# Altium schematic sheet lna.SchDoc: RX LNA
size Letter; CheckedBy: J. Brinton; CompanyName: Signal Laboratories, Inc.; DrawnBy: J. Brinton; Engineer: J. Brinton; Address1: 3479 Edison Way; Address2: Menlo Park CA 94025; Address3: +1 (877) 778-8435; Address4: siglabs.com; Revision: 3; SheetNumber: 14; SheetTotal: 49
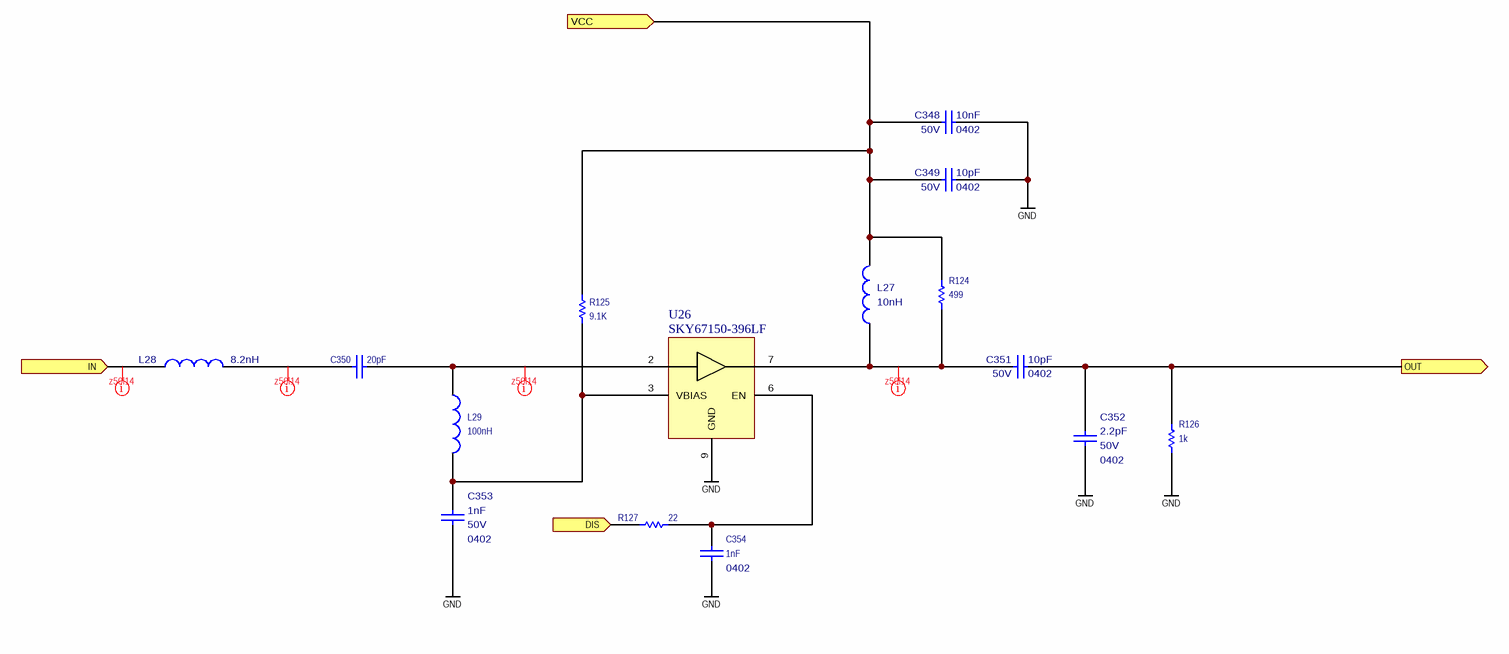
[diagram p0: lna.SchDoc]

## Parts
C348  value 10nF  Package: 0402  Voltage: 50V  [CAPC100X50X55L25N]  (hidden comment: GRM155R71H103KA88)
C349  value 10pF  Package: 0402  Voltage: 50V  [CAPC100X50X55L25N]  (hidden comment: VJ0402A100JXA)
C350  value 20pF  [CAPC100X50X55L25N]  (hidden comment: CBR04C200F5GAC)
C351  value 10pF  Package: 0402  Voltage: 50V  [CAPC100X50X55L25N]  (hidden comment: VJ0402A100JXA)
C352  value 2.2pF  Package: 0402  Voltage: 50V  [CAPC100X50X55L25N]  (hidden comment: VJ0402A2R2BXA)
C353  value 1nF  Package: 0402  Voltage: 50V  [CAPC100X50X55L25N]  (hidden comment: CGA2B2X7R1H102K050BA)
C354  value 1nF  Package: 0402  [CAPC100X50X55L25N]  (hidden comment: CGA2B2NP01H102J050BA)
L27  value 10nH  [INDC1005X55N]  (hidden comment: LQG15HS10NJ02D)
L28  value 8.2nH  [INDC1005X55N]  (hidden comment: LQG15HS8N2H02D)
L29  value 100nH  [INDC1005X55N]  (hidden comment: LQW15ANR10J00D)
R124  value 499  [RESC1005X40N]  (hidden comment: MCS0402PD4990DE500)
R125  value 9.1K  [RESC1005X40N]  (hidden comment: ERJ-2RKF9101X)
R126  value 1k  [RESC1005X40N]  (hidden comment: MCS0402PD1001DE500)
R127  value 22  [RESC1005X40N]  (hidden comment: RC0402FR-0722RL)
U26  SKY67150-396LF  [SON50P200X200X80-9N]

## Ports
DIS (in), IN (in), OUT (out), VCC (in)

## Nets
GND: C348.2 C349.2 C352.2 C353.2 C354.2 R126.1 U26.1(NC) U26.4(NC) U26.5(NC) U26.8(NC) U26.9(GND)
DIS: R127.1 ; port DIS
IN: L28.1 ; port IN
OUT: C351.2 C352.1 R126.2 ; port OUT
VCC: C348.1 C349.1 L27.2 R124.2 R125.1 ; port VCC
NetC350_1: C350.1 L28.2
NetC350_2: C350.2 L29.1 U26.2(RFIN)
NetC351_1: C351.1 L27.1 R124.1 U26.7(RFOUT)
NetC353_1: C353.1 L29.2 R125.2 U26.3(VBIAS)
NetC354_1: C354.1 R127.2 U26.6(EN)

## Layout directives
net class z50l14: IN, NetC350_1, NetC350_2, NetC351_1

## Notes on the sheet
- Title
- Engineer
- Revision
- Drawn By
- Checked By
- Date
- Sheet
- of

## Library data of the parts
C348 = VJ0603Y103JXA: Ceramic Capacitor 10nF ±10% 50V X7R 0402; Manufacturer: Murata; Tr: -55:125; Manufacturer P/N: GRM155R71H103KA88; Tolerance: ±10%
C349 C351 = VJ0402A100JXA: Ceramic Capacitor 10pF ±5% 50V C0G 0402; Manufacturer: Vishay; Tr: -55:150; Manufacturer P/N: VJ0402A100JXA; Tolerance: ±5%
C350 = CAP 0402: Ceramic Capacitor 20pF ±1% 50V NP0 0402; Manufacturer: Kemet; Tr: -55:125; Voltage: 50V; Manufacturer P/N: CBR04C200F5GAC; Package: 0402; Tolerance: ±1%
C352 = VJ0402A2R2BXA: Ceramic Capacitor 2.2pF ±0.1pF 50V C0G 0402; Manufacturer: Vishay; Tr: -55:150; Manufacturer P/N: VJ0402A2R2BXA; Tolerance: ±0.1pF
C353 = VJ0402Y102KXA: Ceramic Capacitor 1nF ±10% 50V X7R 0402; Manufacturer: TDK; Tr: -55:150; Manufacturer P/N: CGA2B2X7R1H102K050BA; Tolerance: ±10%
C354 = CAP 0402: Ceramic Capacitor 1nF ±5% 50V NP0 0402; Manufacturer: TDK; Tr: -55:150; Voltage: 50V; Manufacturer P/N: CGA2B2NP01H102J050BA; Tolerance: ±5%
L27 = INDUCTOR: Inductor 10nH ±5% 500mA; Manufacturer: Murata; Manufacturer P/N: LQG15HS10NJ02D
L28 = INDUCTOR: Inductor 8.2nH ±3% 550mA; Manufacturer: Murata; Manufacturer P/N: LQG15HS8N2H02D
L29 = INDUCTOR: Inductor 100nH ±5% 0402; Manufacturer: Murata; Tr: -55:125; Manufacturer P/N: LQW15ANR10J00D; Package: 0402; Tolerance: ±5%
R124 = RES 0603: Thin Film Resistor 499 Ohm ±0.5% 0402; Manufacturer: Vishay; Tr: -55:175; Package: 0402; Manufacturer P/N: MCS0402PD4990DE500; Do Not Place: *; Tolerance: ±0.5%
R125 = RES 0402: Thick Film Resistor 9.1k ±1% 0.1W 50V 0402; Manufacturer: Panasonic; Tr: -55:155; Package: 0402; Manufacturer P/N: ERJ-2RKF9101X; Tolerance: ±1%
R126 = RES 0603: Thin Film Resistor 1k Ohm ±0.5% 0402; Manufacturer: Vishay; Tr: -55:175; Package: 0402; Manufacturer P/N: MCS0402PD1001DE500; Do Not Place: *; Tolerance: ±0.5%
R127 = RES 0402: Thick Film Resistor 22 ±1% 0402; Manufacturer: Yageo; Tr: -55:155; Package: 0402; Manufacturer P/N: RC0402FR-0722RL; Do Not Place: *; Tolerance: ±1%
U26 = SKY67150-396LF: 300 to 2200 MHz LNA; Manufacturer: Skyworks; Manufacturer P/N: SKY67150-396LF